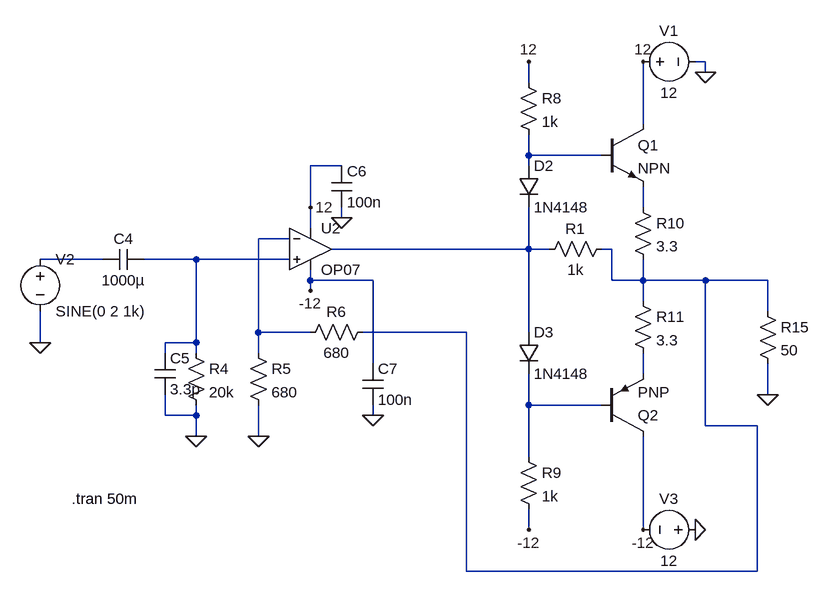
[diagram p0: schematic Gensim.asc]
Gensim.asc, the LTspice schematic file:
Version 4
SHEET 1 2164 680
WIRE 992 -720 976 -720
WIRE 992 -704 992 -720
WIRE 720 -688 720 -720
WIRE 896 -624 896 -720
WIRE 720 -576 720 -608
WIRE 832 -576 720 -576
WIRE 432 -560 384 -560
WIRE 720 -560 720 -576
WIRE 384 -496 384 -560
WIRE 896 -496 896 -528
WIRE 432 -480 432 -496
WIRE 384 -464 384 -496
WIRE 352 -448 304 -448
WIRE 720 -432 720 -496
WIRE 720 -432 416 -432
WIRE 752 -432 720 -432
WIRE 848 -432 832 -432
WIRE 64 -416 -32 -416
WIRE 208 -416 128 -416
WIRE 352 -416 208 -416
WIRE 384 -384 384 -400
WIRE 480 -384 384 -384
WIRE 848 -384 848 -432
WIRE 896 -384 896 -416
WIRE 896 -384 848 -384
WIRE 992 -384 896 -384
WIRE 1088 -384 992 -384
WIRE 384 -368 384 -384
WIRE 896 -352 896 -384
WIRE 1088 -336 1088 -384
WIRE 304 -304 304 -448
WIRE 384 -304 304 -304
WIRE 624 -304 464 -304
WIRE 720 -304 720 -432
WIRE -32 -288 -32 -336
WIRE 208 -288 208 -416
WIRE 208 -288 160 -288
WIRE 160 -272 160 -288
WIRE 208 -272 208 -288
WIRE 304 -272 304 -304
WIRE 480 -256 480 -384
WIRE 896 -240 896 -272
WIRE 1088 -208 1088 -256
WIRE 720 -192 720 -240
WIRE 832 -192 720 -192
WIRE 160 -176 160 -208
WIRE 208 -176 208 -192
WIRE 208 -176 160 -176
WIRE 480 -176 480 -192
WIRE 992 -160 992 -384
WIRE 1072 -160 992 -160
WIRE 208 -144 208 -176
WIRE 304 -144 304 -192
WIRE 720 -112 720 -192
WIRE 720 0 720 -32
WIRE 896 0 896 -144
WIRE 624 64 624 -304
WIRE 1072 64 1072 -160
WIRE 1072 64 624 64
FLAG 208 -144 0
FLAG 304 -144 0
FLAG 720 0 -12
FLAG 896 0 -12
FLAG 384 -368 -12
FLAG 384 -496 12
FLAG 720 -720 12
FLAG 480 -176 0
FLAG 432 -480 0
FLAG 896 -720 12
FLAG -32 -288 0
FLAG 1088 -208 0
FLAG 976 0 0
FLAG 992 -704 0
SYMBOL cap 128 -432 R90
WINDOW 0 0 32 VBottom 2
WINDOW 3 32 32 VTop 2
SYMATTR InstName C4
SYMATTR Value 1000µ
SYMBOL cap 144 -272 R0
SYMATTR InstName C5
SYMATTR Value 3.3p
SYMBOL res 192 -288 R0
SYMATTR InstName R4
SYMATTR Value 20k
SYMBOL res 288 -288 R0
SYMATTR InstName R5
SYMATTR Value 680
SYMBOL res 480 -320 R90
WINDOW 0 0 56 VBottom 2
WINDOW 3 32 56 VTop 2
SYMATTR InstName R6
SYMATTR Value 680
SYMBOL diode 704 -560 R0
SYMATTR InstName D2
SYMATTR Value 1N4148
SYMBOL diode 704 -304 R0
SYMATTR InstName D3
SYMATTR Value 1N4148
SYMBOL res 704 -704 R0
SYMATTR InstName R8
SYMATTR Value 1k
SYMBOL res 704 -128 R0
SYMATTR InstName R9
SYMATTR Value 1k
SYMBOL npn 832 -624 R0
SYMATTR InstName Q1
SYMBOL pnp 832 -144 M180
SYMATTR InstName Q2
SYMBOL res 880 -512 R0
SYMATTR InstName R10
SYMATTR Value 3.3
SYMBOL res 880 -368 R0
SYMATTR InstName R11
SYMATTR Value 3.3
SYMBOL voltage -32 -432 R0
WINDOW 123 0 0 Left 0
WINDOW 39 0 0 Left 0
SYMATTR InstName V2
SYMATTR Value SINE(0 2 1k)
SYMBOL cap 416 -560 R0
SYMATTR InstName C6
SYMATTR Value 100n
SYMBOL cap 464 -256 R0
SYMATTR InstName C7
SYMATTR Value 100n
SYMBOL OpAmps\\OP07 384 -496 R0
SYMATTR InstName U2
SYMBOL res 1072 -352 R0
SYMATTR InstName R15
SYMATTR Value 50
SYMBOL voltage 880 -720 R270
WINDOW 0 32 56 VTop 2
WINDOW 3 -32 56 VBottom 2
WINDOW 123 0 0 Left 0
WINDOW 39 0 0 Left 0
SYMATTR InstName V1
SYMATTR Value 12
SYMBOL voltage 992 0 R90
WINDOW 0 -32 56 VBottom 2
WINDOW 3 32 56 VTop 2
WINDOW 123 0 0 Left 0
WINDOW 39 0 0 Left 0
SYMATTR InstName V3
SYMATTR Value 12
SYMBOL res 848 -448 R90
WINDOW 0 0 56 VBottom 2
WINDOW 3 32 56 VTop 2
SYMATTR InstName R1
SYMATTR Value 1k
TEXT 16 -48 Left 2 !.tran 50m

The netlist it stands for:
* Gensim.asc
C4 N007 N006 1000µ
C5 N007 0 3.3p
R4 N007 0 20k
R5 N003 0 680
R6 N005 N003 680
D2 N001 N004 1N4148
D3 N004 N009 1N4148
R8 12 N001 1k
R9 N009 -12 1k
Q1 12 N001 N002 0 NPN
Q2 -12 N009 N008 0 PNP
R10 N002 N005 3.3
R11 N005 N008 3.3
V2 N006 0 SINE(0 2 1k)
C6 12 0 100n
C7 -12 0 100n
XU2 N007 N003 12 -12 N004 LT1001  ; OP07, pins In+ In- V+ V- OUT
R15 N005 0 50
V1 12 0 12
V3 0 -12 12
R1 N005 N004 1k
.model D D
.lib standard.dio
.model NPN NPN
.model PNP PNP
.lib standard.bjt
.tran 50m
.lib LTC.lib
.backanno
.end